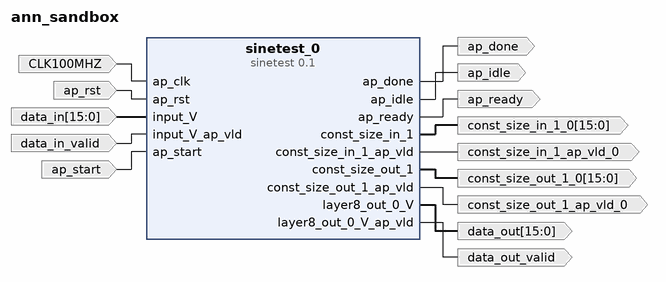
[diagram p0: block diagram of the top level]
# Vivado block design ann_sandbox, xc7a100tcsg324-1, Vivado 2020.1
create_bd_design ann_sandbox

create_bd_port -dir I -type clk CLK100MHZ
create_bd_port -dir I -type rst ap_rst
set_property -dict {CONFIG.POLARITY ACTIVE_HIGH} [get_bd_ports ap_rst]
create_bd_port -dir O -from 15 -to 0 -type data const_size_in_1_0
create_bd_port -dir O const_size_in_1_ap_vld_0
create_bd_port -dir O -from 15 -to 0 -type data const_size_out_1_0
create_bd_port -dir O const_size_out_1_ap_vld_0
create_bd_port -dir I -from 15 -to 0 -type data data_in
create_bd_port -dir I data_in_valid
create_bd_port -dir O -from 15 -to 0 -type data data_out
create_bd_port -dir O data_out_valid
create_bd_port -dir I ap_start
create_bd_port -dir O ap_done
create_bd_port -dir O ap_ready
create_bd_port -dir O ap_idle

create_bd_cell -type ip -vlnv JochiSt:SineTest:sinetest:0.1 sinetest_0

# ---- connections ----

connect_bd_net -net ap_clk_0_1 [get_bd_ports CLK100MHZ] [get_bd_pins sinetest_0/ap_clk]
connect_bd_net -net ap_rst_0_1 [get_bd_ports ap_rst] [get_bd_pins sinetest_0/ap_rst]
connect_bd_net [get_bd_pins sinetest_0/const_size_in_1] [get_bd_ports const_size_in_1_0]
connect_bd_net [get_bd_pins sinetest_0/const_size_in_1_ap_vld] [get_bd_ports const_size_in_1_ap_vld_0]
connect_bd_net [get_bd_pins sinetest_0/const_size_out_1] [get_bd_ports const_size_out_1_0]
connect_bd_net [get_bd_pins sinetest_0/const_size_out_1_ap_vld] [get_bd_ports const_size_out_1_ap_vld_0]
connect_bd_net -net input_V_0_1 [get_bd_ports data_in] [get_bd_pins sinetest_0/input_V]
connect_bd_net -net input_V_ap_vld_0_1 [get_bd_ports data_in_valid] [get_bd_pins sinetest_0/input_V_ap_vld]
connect_bd_net -net sinetest_0_layer16_out_0_V [get_bd_pins sinetest_0/layer8_out_0_V] [get_bd_ports data_out]
connect_bd_net -net sinetest_0_layer16_out_0_V_ap_vld [get_bd_pins sinetest_0/layer8_out_0_V_ap_vld] [get_bd_ports data_out_valid]
connect_bd_net [get_bd_ports ap_start] [get_bd_pins sinetest_0/ap_start]
connect_bd_net [get_bd_pins sinetest_0/ap_done] [get_bd_ports ap_done]
connect_bd_net [get_bd_pins sinetest_0/ap_ready] [get_bd_ports ap_ready]
connect_bd_net [get_bd_pins sinetest_0/ap_idle] [get_bd_ports ap_idle]

validate_bd_design
save_bd_design
